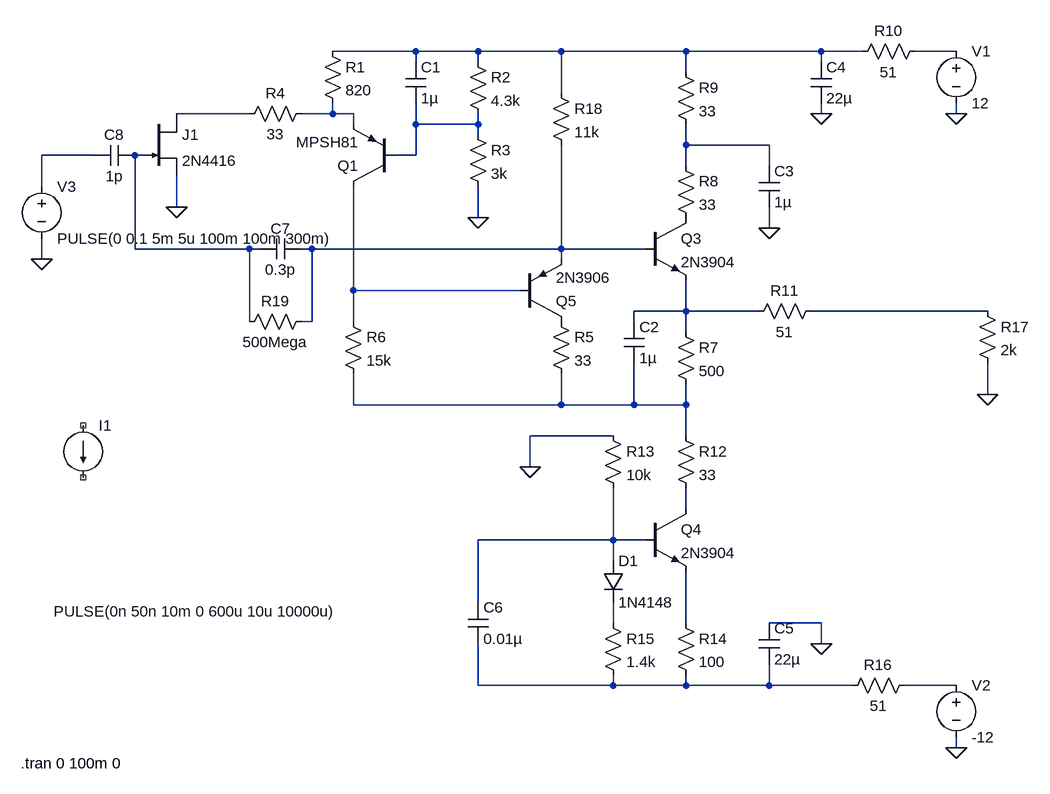
[diagram p0: schematic CSP_with_resistor.asc]
CSP_with_resistor.asc, the LTspice schematic file:
Version 4
SHEET 1 948 824
WIRE 0 -288 -128 -288
WIRE 96 -288 0 -288
WIRE 224 -288 96 -288
WIRE 416 -288 224 -288
WIRE 624 -288 416 -288
WIRE 688 -288 624 -288
WIRE 832 -288 768 -288
WIRE 0 -272 0 -288
WIRE 96 -272 96 -288
WIRE 624 -272 624 -288
WIRE 416 -256 416 -288
WIRE 224 -224 224 -288
WIRE -256 -192 -368 -192
WIRE -128 -192 -128 -208
WIRE -128 -192 -176 -192
WIRE -96 -192 -128 -192
WIRE 624 -192 624 -208
WIRE 832 -192 832 -208
WIRE -96 -176 -96 -192
WIRE 0 -176 0 -208
WIRE 96 -176 96 -192
WIRE 96 -176 0 -176
WIRE 96 -160 96 -176
WIRE 416 -144 416 -176
WIRE 544 -144 416 -144
WIRE -496 -128 -576 -128
WIRE -416 -128 -432 -128
WIRE 0 -128 0 -176
WIRE 0 -128 -32 -128
WIRE 416 -112 416 -144
WIRE 544 -112 544 -144
WIRE -576 -80 -576 -128
WIRE -368 -48 -368 -96
WIRE 96 -32 96 -80
WIRE 544 -16 544 -48
WIRE -432 16 -432 -128
WIRE -256 16 -432 16
WIRE -240 16 -256 16
WIRE -160 16 -176 16
WIRE 224 16 224 -144
WIRE 224 16 -160 16
WIRE 352 16 224 16
WIRE -576 32 -576 0
WIRE 224 32 224 16
WIRE -96 80 -96 -80
WIRE 160 80 -96 80
WIRE 416 112 416 64
WIRE 416 112 336 112
WIRE 528 112 416 112
WIRE 880 112 608 112
WIRE -256 128 -256 16
WIRE -160 128 -160 16
WIRE -160 128 -176 128
WIRE -96 128 -96 80
WIRE 336 128 336 112
WIRE 416 144 416 112
WIRE 880 240 880 192
WIRE -96 256 -96 208
WIRE 224 256 224 208
WIRE 224 256 -96 256
WIRE 336 256 336 192
WIRE 336 256 224 256
WIRE 416 256 416 224
WIRE 416 256 336 256
WIRE 304 304 176 304
WIRE 416 304 416 256
WIRE 176 352 176 304
WIRE 416 416 416 384
WIRE 304 464 304 384
WIRE 304 464 96 464
WIRE 352 464 304 464
WIRE 304 496 304 464
WIRE 96 560 96 464
WIRE 304 592 304 560
WIRE 416 592 416 512
WIRE 624 592 544 592
WIRE 624 624 624 592
WIRE 96 688 96 624
WIRE 304 688 304 672
WIRE 304 688 96 688
WIRE 416 688 416 672
WIRE 416 688 304 688
WIRE 544 688 544 656
WIRE 544 688 416 688
WIRE 672 688 544 688
WIRE 832 688 752 688
WIRE 832 784 832 768
FLAG 544 -16 0
FLAG 624 -192 0
FLAG 176 352 0
FLAG 624 624 0
FLAG 832 784 0
FLAG 832 -192 0
FLAG 880 240 0
FLAG -576 32 0
FLAG -368 -48 0
FLAG 96 -32 0
SYMBOL res -144 -304 R0
SYMATTR InstName R1
SYMATTR Value 820
SYMBOL cap -16 -272 R0
SYMATTR InstName C1
SYMATTR Value 1µ
SYMBOL res 80 -288 R0
SYMATTR InstName R2
SYMATTR Value 4.3k
SYMBOL pnp -32 -80 R180
SYMATTR InstName Q1
SYMATTR Value MPSH81
SYMBOL res 80 -176 R0
SYMATTR InstName R3
SYMATTR Value 3k
SYMBOL res -160 -208 R90
WINDOW 0 0 56 VBottom 2
WINDOW 3 32 56 VTop 2
SYMATTR InstName R4
SYMATTR Value 33
SYMBOL res 208 112 R0
SYMATTR InstName R5
SYMATTR Value 33
SYMBOL res -112 112 R0
SYMATTR InstName R6
SYMATTR Value 15k
SYMBOL npn 352 -32 R0
SYMATTR InstName Q3
SYMATTR Value 2N3904
SYMBOL cap 320 128 R0
SYMATTR InstName C2
SYMATTR Value 1µ
SYMBOL res 400 128 R0
SYMATTR InstName R7
SYMATTR Value 500
SYMBOL res 400 -128 R0
SYMATTR InstName R8
SYMATTR Value 33
SYMBOL res 400 -272 R0
SYMATTR InstName R9
SYMATTR Value 33
SYMBOL cap 528 -112 R0
SYMATTR InstName C3
SYMATTR Value 1µ
SYMBOL cap 608 -272 R0
SYMATTR InstName C4
SYMATTR Value 22µ
SYMBOL res 784 -304 R90
WINDOW 0 0 56 VBottom 2
WINDOW 3 32 56 VTop 2
SYMATTR InstName R10
SYMATTR Value 51
SYMBOL res 624 96 R90
WINDOW 0 0 56 VBottom 2
WINDOW 3 32 56 VTop 2
SYMATTR InstName R11
SYMATTR Value 51
SYMBOL res 400 288 R0
SYMATTR InstName R12
SYMATTR Value 33
SYMBOL res 288 288 R0
SYMATTR InstName R13
SYMATTR Value 10k
SYMBOL npn 352 416 R0
SYMATTR InstName Q4
SYMATTR Value 2N3904
SYMBOL res 400 576 R0
SYMATTR InstName R14
SYMATTR Value 100
SYMBOL cap 528 592 R0
SYMATTR InstName C5
SYMATTR Value 22µ
SYMBOL diode 288 496 R0
SYMATTR InstName D1
SYMATTR Value 1N4148
SYMBOL res 288 576 R0
SYMATTR InstName R15
SYMATTR Value 1.4k
SYMBOL cap 80 560 R0
SYMATTR InstName C6
SYMATTR Value 0.01µ
SYMBOL res 768 672 R90
WINDOW 0 0 56 VBottom 2
WINDOW 3 32 56 VTop 2
SYMATTR InstName R16
SYMATTR Value 51
SYMBOL njf -416 -192 R0
SYMATTR InstName J1
SYMATTR Value 2N4416
SYMBOL voltage 832 -304 R0
WINDOW 123 0 0 Left 0
WINDOW 39 0 0 Left 0
SYMATTR InstName V1
SYMATTR Value 12
SYMBOL voltage 832 672 R0
WINDOW 123 0 0 Left 0
WINDOW 39 0 0 Left 0
SYMATTR InstName V2
SYMATTR Value -12
SYMBOL res 864 96 R0
SYMATTR InstName R17
SYMATTR Value 2k
SYMBOL cap -176 0 R90
WINDOW 0 0 32 VBottom 2
WINDOW 3 32 32 VTop 2
SYMATTR InstName C7
SYMATTR Value 0.3p
SYMBOL current -512 288 R0
WINDOW 3 -45 286 Left 2
WINDOW 123 0 0 Left 0
WINDOW 39 0 0 Left 0
SYMATTR Value PULSE(0n 50n 10m 0 600u 10u 10000u)
SYMATTR InstName I1
SYMBOL res 208 -240 R0
SYMATTR InstName R18
SYMATTR Value 11k
SYMBOL pnp 160 128 M180
SYMATTR InstName Q5
SYMATTR Value 2N3906
SYMBOL res -160 112 R90
WINDOW 0 0 56 VBottom 2
WINDOW 3 32 56 VTop 2
SYMATTR InstName R19
SYMATTR Value 500Mega
SYMBOL cap -432 -144 R90
WINDOW 0 0 32 VBottom 2
WINDOW 3 32 32 VTop 2
SYMATTR InstName C8
SYMATTR Value 1p
SYMBOL voltage -576 -96 R0
WINDOW 123 0 0 Left 0
WINDOW 39 0 0 Left 0
SYMATTR InstName V3
SYMATTR Value PULSE(0 0.1 5m 5u 100m 100m 300m)
TEXT -608 808 Left 2 !.tran 0 100m 0

The netlist it stands for:
* CSP_with_resistor.asc
R1 N001 N004 820
C1 N001 N005 1µ
R2 N001 N005 4.3k
Q1 N010 N005 N004 0 MPSH81
R3 N005 0 3k
R4 N004 N003 33
R5 P001 N013 33
R6 N010 N013 15k
Q3 P002 N009 N011 0 2N3904
C2 N011 N013 1µ
R7 N011 N013 500
R8 N006 P002 33
R9 N001 N006 33
C3 N006 0 1µ
C4 N001 0 22µ
R10 N002 N001 51
R11 N012 N011 51
R12 N013 N014 33
R13 0 N015 10k
Q4 N014 N015 N017 0 2N3904
R14 N017 N018 100
C5 0 N018 22µ
D1 N015 N016 1N4148
R15 N016 N018 1.4k
C6 N015 N018 0.01µ
R16 N019 N018 51
J1 N003 N008 0 2N4416
V1 N002 0 12
V2 N019 0 -12
R17 N012 0 2k
C7 N009 N008 0.3p
I1 NC_01 NC_02 PULSE(0n 50n 10m 0 600u 10u 10000u)
R18 N001 N009 11k
Q5 P001 N010 N009 0 2N3906
R19 N009 N008 500Mega
C8 N008 N007 1p
V3 N007 0 PULSE(0 0.1 5m 5u 100m 100m 300m)
.model D D
.lib standard.dio
.model NPN NPN
.model PNP PNP
.lib standard.bjt
.model NJF NJF
.model PJF PJF
.lib standard.jft
.tran 0 100m 0
.backanno
.end